# Altium schematic sheet Raspberry Pi.SchDoc
size A4; SheetNumber: 9; SheetTotal: 12
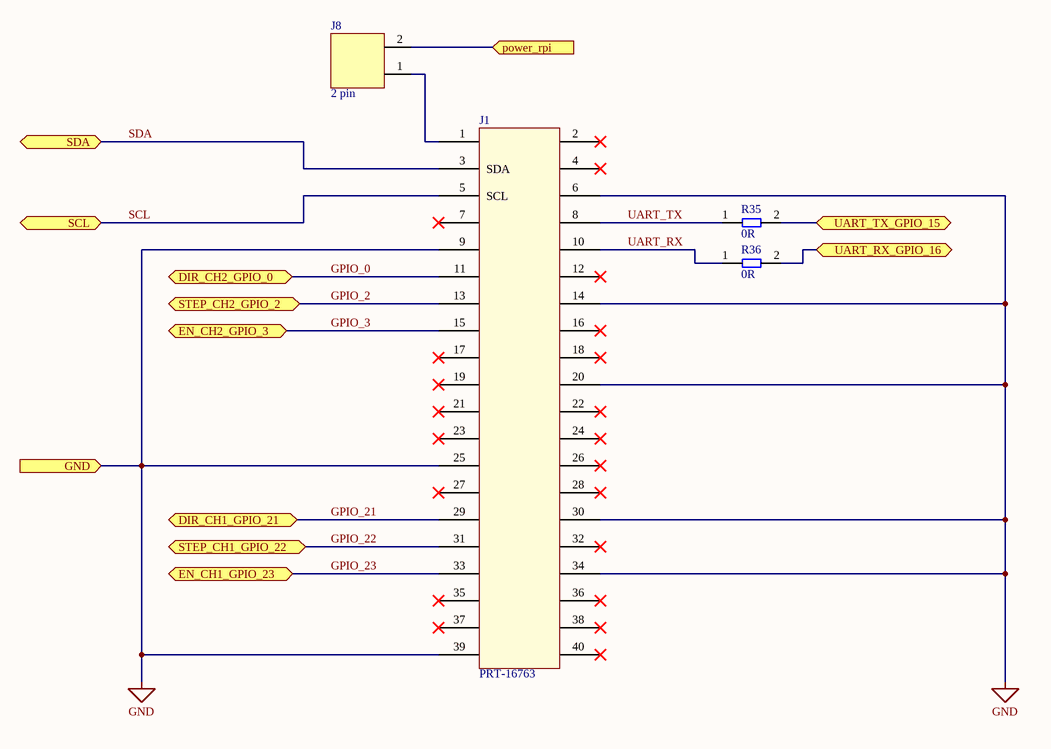
[diagram p0: Raspberry Pi.SchDoc]

## Parts
J1  PRT-16763  [FP-SFH11-PBPC-D20-ST-BK-MFG]
J8  2 pin  [2 pin header]
R35  0R  [0805 Resistor - IPC A]
R36  0R  [0805 Resistor - IPC A]

## Ports
DIR_CH1_GPIO_21 (bidir, see Callisto Control Board[3B]), DIR_CH2_GPIO_0 (bidir, see Callisto Control Board[3A]), EN_CH1_GPIO_23 (bidir, see Callisto Control Board[3A]), EN_CH2_GPIO_3 (bidir, see Callisto Control Board[3A]), GND (in, see Callisto Control Board[4A], 3V3 LDO[3B], BME280[3B], Driver Board[1B], INA219_CH1[1A], INA219_CH2[1B], INA219_CH3[1B], INA219_CH4[1B], INA219_CH5[1B], INA219_CH6[1B]), power_rpi (in, see Callisto Control Board[4B]), SCL (bidir, see Callisto Control Board[4A], BME280[3B], INA219_CH1[1C], INA219_CH2[1C], INA219_CH3[1C], INA219_CH4[1C], INA219_CH5[1C], INA219_CH6[1C]), SDA (bidir, see Callisto Control Board[4A], BME280[3B], INA219_CH1[1C], INA219_CH2[1C], INA219_CH3[1C], INA219_CH4[1C], INA219_CH5[1C], INA219_CH6[1C]), STEP_CH1_GPIO_22 (bidir, see Callisto Control Board[3A]), STEP_CH2_GPIO_2 (bidir, see Callisto Control Board[3A]), UART_RX_GPIO_16 (bidir, see Callisto Control Board[3B]), UART_TX_GPIO_15 (bidir, see Callisto Control Board[3B])

## Nets
GND: J1.6 J1.9 J1.14 J1.20 J1.25 J1.30 J1.34 J1.39 ; port GND
GPIO_0: J1.11 ; port DIR_CH2_GPIO_0
GPIO_2: J1.13 ; port STEP_CH2_GPIO_2
GPIO_3: J1.15 ; port EN_CH2_GPIO_3
GPIO_21: J1.29 ; port DIR_CH1_GPIO_21
GPIO_22: J1.31 ; port STEP_CH1_GPIO_22
GPIO_23: J1.33 ; port EN_CH1_GPIO_23
power_rpi: J8.2 ; port power_rpi
SCL: J1.5(SCL) ; port SCL
SDA: J1.3(SDA) ; port SDA
UART_RX: J1.10 R36.1
UART_RX_GPIO_16: R36.2 ; port UART_RX_GPIO_16
UART_TX: J1.8 R35.1
UART_TX_GPIO_15: R35.2 ; port UART_TX_GPIO_15
NetJ1_1: J1.1 J8.1

Not connected (* = marked no-connect by the designer): J1 2* 4* 7* 12* 16* 17* 18* 19* 21* 22* 23* 24* 26* 27* 28* 32* 35* 36* 37* 38* 40*

## Library data of the parts
J1 = Raspberry Pi 3+ Header: Headers & Wire Housings Extended GPIO Female Header - 2x20 Pin (16mm/7.30mm)
J8 = 2 pin male header 0.254mm
R35 R36 = RC0805JR-070RL: Thick Film Resistors - SMD 0 Ohms 125 mW 0805 5% / RC0805JR-070RL